# EAGLE design Narrow AAA sensor (EAGLE 8.3.1)
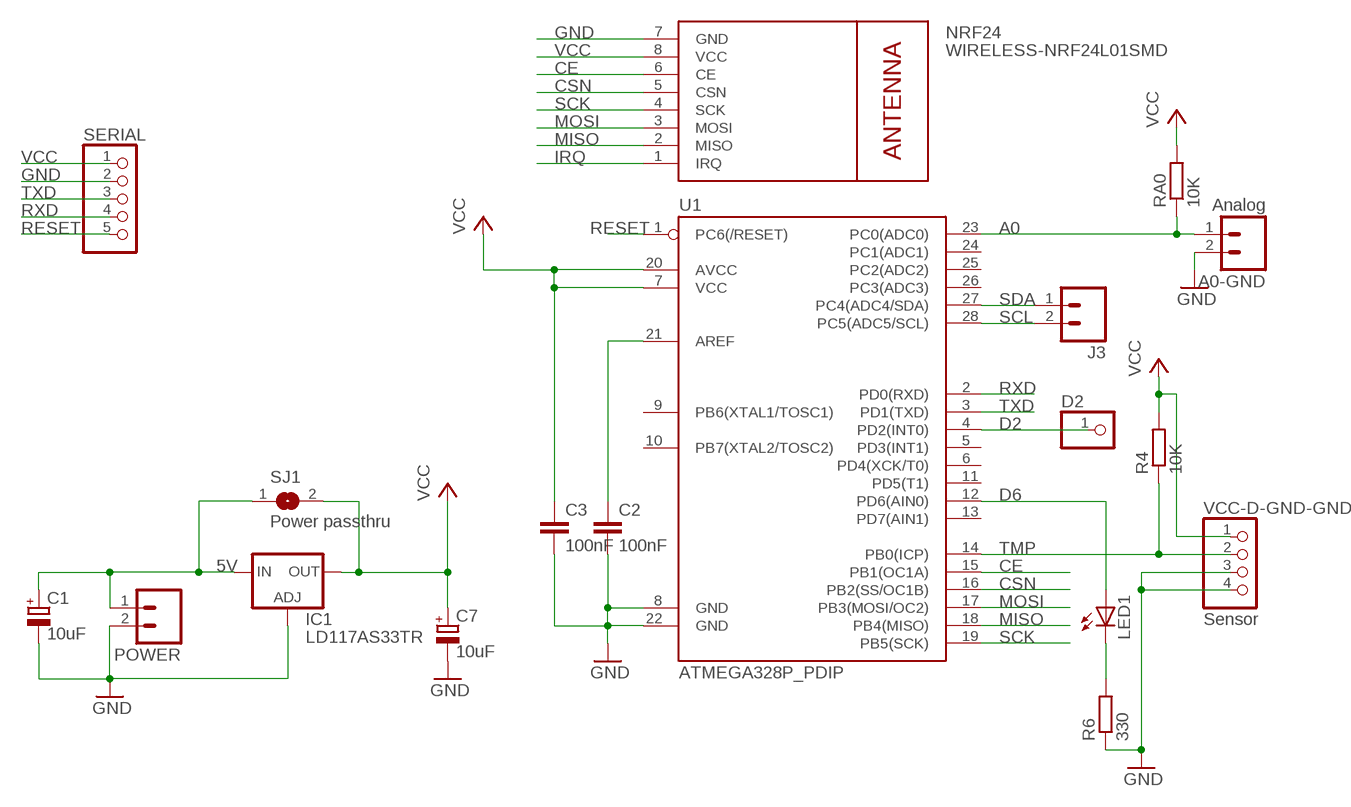
[diagram p0: schematic, sheet 1]

## Parts
A0-GND  Analog  M02PTH  [1X02]
C1  10uF  CPOL-EUE2.5-5  [E2,5-5]
C2  100nF  C-EU025-025X050  [C025-025X050]
C3  100nF  C-EU025-025X050  [C025-025X050]
C7  10uF  CPOL-EUE2.5-5  [E2,5-5]
D2  PINHD-1X1  [1X01]
IC1  LD117AS33TR  [SOT223]
J3  M021X02_NO_SILK  [1X02_NO_SILK]
LED1  LED3MM  [LED3MM]
NRF24  WIRELESS-NRF24L01SMD  [WIRELESS-NRF24L01-SMD]
POWER  M021X02_NO_SILK  [1X02_NO_SILK]
R4  10K  R-EU_0204/7  [0204/7]
R6  330  R-EU_0204/7  [0204/7]
RA0  10K  R-EU_0204/7  [0204/7]
SERIAL  PINHD-1X5  [1X05]
SJ1  Power passthru  SJ  [SJ]
U1  ATMEGA328P_PDIP  [DIL28-3]
VCC-D-GND-GND  Sensor  PINHD-1X4  [1X04]

## Nets
5V: C1.+ IC1.3(IN) POWER.1 SJ1.1
A0: A0-GND.1 RA0.1 U1.23(PC0(ADC0))
CE: NRF24.6(CE) U1.15(PB1(OC1A))
CSN: NRF24.5(CSN) U1.16(PB2(SS/OC1B))
D2: D2.1 U1.4(PD2(INT0))
D6: LED1.A U1.12(PD6(AIN0))
GND [power]: A0-GND.2 C1.- C2.2 C3.2 C7.- IC1.1(ADJ) NRF24.7(GND) POWER.2 R6.1 SERIAL.2 U1.8(GND) U1.22(GND) VCC-D-GND-GND.3 VCC-D-GND-GND.4
IRQ: NRF24.1(IRQ)
MISO: NRF24.2(MISO) U1.18(PB4(MISO))
MOSI: NRF24.3(MOSI) U1.17(PB3(MOSI/OC2))
N$1: LED1.K(C) R6.2
N$8: C2.1 U1.21(AREF)
RESET: SERIAL.5 U1.1(PC6(/RESET))
RXD: SERIAL.4 U1.2(PD0(RXD))
SCK: NRF24.4(SCK) U1.19(PB5(SCK))
SCL: J3.2 U1.28(PC5(ADC5/SCL))
SDA: J3.1 U1.27(PC4(ADC4/SDA))
TMP: R4.1 U1.14(PB0(ICP)) VCC-D-GND-GND.2
TXD: SERIAL.3 U1.3(PD1(TXD))
VCC [power]: C3.1 C7.+ IC1.4(OUT) NRF24.8(VCC) R4.2 RA0.2 SERIAL.1 SJ1.2 U1.7(VCC) U1.20(AVCC) VCC-D-GND-GND.1
Unconnected: U1.5(PD3(INT1)) U1.6(PD4(XCK/T0)) U1.9(PB6(XTAL1/TOSC1)) U1.10(PB7(XTAL2/TOSC2)) U1.11(PD5(T1)) U1.13(PD7(AIN1)) U1.24(PC1(ADC1)) U1.25(PC2(ADC2)) U1.26(PC3(ADC3))

## Library data of the parts
A0-GND J3 POWER = SparkFun-Connectors:M02: Standard 2-pin 0.1" header. Use with - straight break away headers ( PRT-00116) - right angle break away headers (PRT-00553) - swiss pins (PRT-00743) - machine pins (PRT-00117) - female headers (PRT-00115) Molex polarized connector foot print use with: PRT-08233 with associated crimp pins and housings. 2.54_SCREWTERM for use with PRT-10571. 3.5mm Screw Terminal footprints for PRT-08084 5mm Screw Terminal footprints for use with PRT-08432
C1 C7 = rcl:CPOL-EU: POLARIZED CAPACITOR, European symbol
C2 C3 = GertSanders:C-EU: CAPACITOR, European symbol
D2 = pinhead:PINHD-1X1: PIN HEADER
IC1 = v-reg:LD117A?*: Low drop fixed and adjustable positive voltage regulators 1 A Source: http://www.st.com/stonline/products/literature/ds/7194/ld1117axx.pdf
LED1 = adafruit:LED: LED OSRAM: - CHIPLED LG R971, LG N971, LY N971, LG Q971, LY Q971, LO R971, LY R971 LH N974, LH R974 LS Q976, LO Q976, LY Q976 LO Q996 - Hyper CHIPLED LW Q18S LB Q993, LB Q99A, LB R99A - SideLED LS A670, LO A670, LY A670, LG A670, LP A670 LB A673, LV A673, LT A673, LW A673 LH A674 LY A675 LS A676, LA A676, LO A676, LY A676, LW A676 LS A679, LY A679, LG A679 - Hyper Micro SIDELED® LS Y876, LA Y876, LO Y876, LY Y876 LT Y87S - SmartLED LW L88C, LW L88S LB L89C, LB L89S, LG L890 LS L89K, LO L89K, LY L89K LS L896, LA L896, LO L896, LY L896 - TOPLED LS T670, LO T670, LY T670, LG T670, LP T670 LSG T670, LSP T670, LSY T670, LOP T670, LYG T670 LG T671, LOG T671, LSG T671 LB T673, LV T673, LT T673, LW T673 LH T674 LS T676, LA T676, LO T676, LY T676, LB T676, LH T676, LSB T676, LW T676 LB T67C, LV T67C, LT T67C, LS T67K, LO T67K, LY T67K, LW E67C LS E67B, LA E67B, LO E67B, LY E67B, LB E67C, LV E67C, LT E67C LW T67C LS T679, LY T679, LG T679 LS T770, LO T770, LY T770, LG T770, LP T770 LB T773, LV T773, LT T773, LW T773 LH T774 LS E675, LA E675, LY E675, LS T675 LS T776, LA T776, LO T776, LY T776, LB T776 LHGB T686 LT T68C, LB T68C - Hyper Mini TOPLED® LB M676 - Mini TOPLED Santana® LG M470 LS M47K, LO M47K, LY M47K Source: http://www.osram.convergy.de/
NRF24 = GertSanders:WIRELESS-NRF24L01: 2.4 GHz Wireless Module based on NRF24L01 chip
R4 R6 RA0 = rcl:R-EU_: RESISTOR, European symbol
SERIAL = pinhead:PINHD-1X5: PIN HEADER
SJ1 = jumper:SJ: SMD solder JUMPER
U1 = GertSanders:ATMEGA328P_PDIP: uC used in the Arduino 32kb flash, 1k EEPROM, 2k SRAM This is the through-hole version of this chip.
VCC-D-GND-GND = pinhead:PINHD-1X4: PIN HEADER

## Net classes
1 power: width 0.356 mm, clearance 0.178 mm

## Board
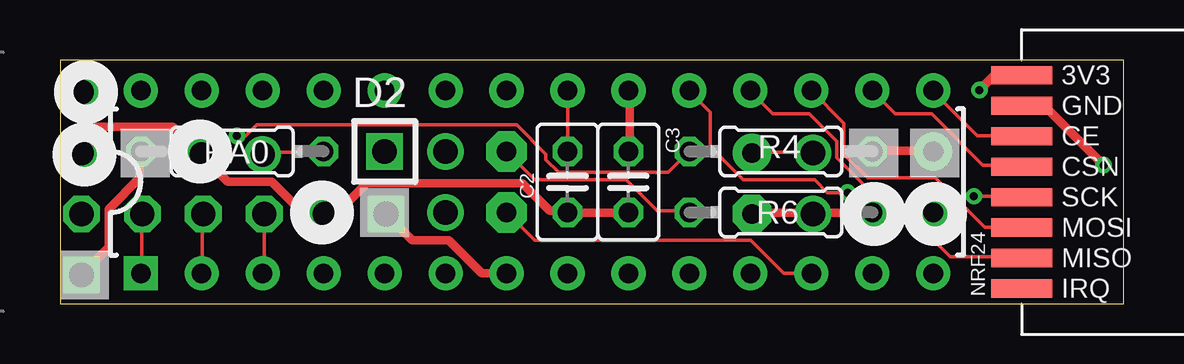
[diagram p1: board, top side]
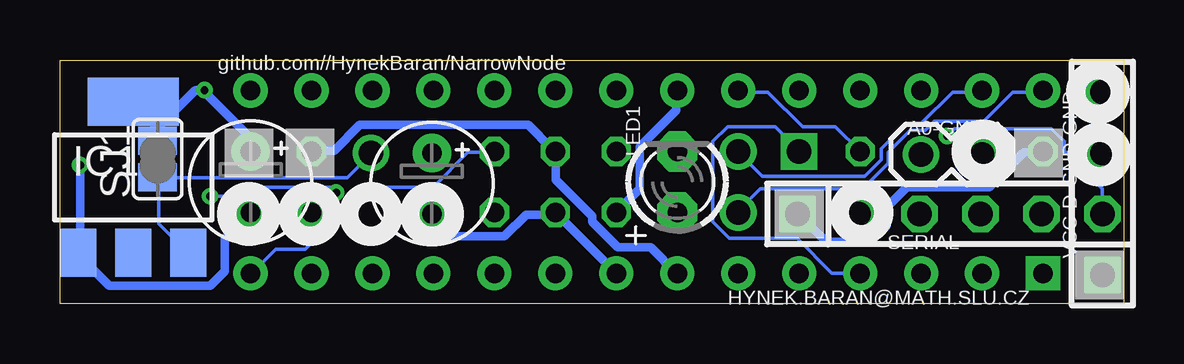
[diagram p2: board, bottom side, seen from below]

Size 44.32 x 10.16 mm. Coordinates in mm from the lower left corner, seen from the top.
Outline: 0,0 44.32,0 44.32,10.16 0,10.16 0,0
Copper layers (1*16): Top 0.0356mm / dielectric 1.5011mm / Bottom 0.0356mm
Design rules "oshpark-2layer": minimum track width 6mil, minimum drill 13mil, track to track 6mil, track to pad 6mil, pad to pad 6mil, via to via 6mil, smd to smd 6mil, copper to edge 15mil, drill to drill 6mil, minimum pad ring 7mil, minimum via ring 7mil, stop-mask expansion 2.5mil, vias tented up to drill 0mil, thermal gap 10mil

### Footprints (pad centres in the part's own frame; a part is rotated, then mirrored left to right if it is on the bottom)
1X02 = drill 1.016 pad 1.422: 1 0,0; 2 2.54,0
E2,5-5 = drill 0.813 pad 1.6: + -1.27,0 | drill 0.813 pad 1.6 octagon: - 1.27,0
C025-025X050 = drill 0.813 octagon: 1 -1.27,0; 2 1.27,0
1X01 = drill 1.016 square: 1 0,0
SOT223 = smd 1.5 x 2: 1 -2.3,-3.15; 2 0,-3.15; 3 2.3,-3.15 | smd 3.8 x 2: 4 0,3.15
1X02_NO_SILK = drill 1.016 pad 1.422: 1 0,0; 2 2.54,0
LED3MM = drill 0.813 pad 1.676 octagon: A -1.27,0; K 1.27,0
WIRELESS-NRF24L01-SMD = smd 2.54 x 0.762: 1 1.27,0; 2 1.27,1.27; 3 1.27,2.54; 4 1.27,3.81; 5 1.27,5.08; 6 1.27,6.35; 7 1.27,7.62; 8 1.27,8.89
0204/7 = drill 0.813 octagon: 1 -3.81,0; 2 3.81,0
1X05 = drill 1.016 square: 1 -5.08,0 | drill 1.016 octagon: 2 -2.54,0; 3 0,0; 4 2.54,0; 5 5.08,0
SJ = smd 1.168 x 1.6: 1 -0.762,0; 2 0.762,0
DIL28-3 = drill 0.813 pad 1.422 square: 1 -16.51,-3.81 | drill 0.813 pad 1.422: 2 -13.97,-3.81; 3 -11.43,-3.81; 4 -8.89,-3.81; 5 -6.35,-3.81; 6 -3.81,-3.81; 7 -1.27,-3.81; 8 1.27,-3.81; 9 3.81,-3.81; 10 6.35,-3.81; 11 8.89,-3.81; 12 11.43,-3.81; 13 13.97,-3.81; 14 16.51,-3.81; 15 16.51,3.81; 16 13.97,3.81; 17 11.43,3.81; 18 8.89,3.81; 19 6.35,3.81; 20 3.81,3.81; 21 1.27,3.81; 22 -1.27,3.81; 23 -3.81,3.81; 24 -6.35,3.81; 25 -8.89,3.81; 26 -11.43,3.81; 27 -13.97,3.81; 28 -16.51,3.81
1X04 = drill 1.016 square: 1 -3.81,0 | drill 1.016 octagon: 2 -1.27,0; 3 1.27,0; 4 3.81,0

### Placement (x,y rotation side)
A0-GND  8.45,6.22 0 bottom
C1  28.83,5.02 270 bottom
C2  21.15,5.08 270 top
C3  23.69,5.08 270 top
C7  36.39,5.08 270 bottom
D2  13.53,6.35 0 top
IC1  41.27,5.27 0 bottom
J3  16.07,6.35 270 top
LED1  18.61,5.08 90 bottom
NRF24  38.8,0.64 0 top
POWER  31.37,6.29 270 top
R4  30.04,6.35 0 top
R6  30.04,3.81 180 top
RA0  7.18,6.35 180 top
SERIAL  8.51,3.75 0 bottom
SJ1  40.26,6.03 90 bottom
U1  19.88,5.08 0 top
VCC-D-GND-GND  0.89,5.02 90 bottom

### Tracks (layer width: path | path; a pad name or v marks a point on that pad's centre or on a via)
5V
  Top 0.152: POWER.1 31.37,6.31 28.85,6.31 C1.+
  Bottom 0.152: IC1.3 38.99,2.12 40.21,3.34 40.21,5.25 SJ1.1 40.13,5.25 32.36,5.25 31.37,6.24 POWER.1
A0
  Top 0.152: RA0.1 10.95,6.31 8.58,6.31 8.51,6.24 A0-GND.1
  Bottom 0.152: RA0.1 12.01,7.38 13.39,7.38 14.83,8.83 16.05,8.83 U1.23
CE
  Top 0.152: NRF24.6 40.06,7 38.23,7 36.4,8.83 U1.15
CSN
  Top 0.152: NRF24.5 40.06,5.78 38.46,5.78 36.32,7.91 34.8,7.91 33.88,8.83 U1.16
D2
  Bottom 0.152: U1.4 11.02,1.28 12.17,1.28 13.61,2.73 16.43,2.73 17.12,3.42 17.12,6.77 16.51,7.38 14.53,7.38 13.54,6.39 D2.1
D6
  Top 0.152: U1.12 30.15,1.28 28.78,2.65 19.79,2.65 18.64,3.8 LED1.A
GND  (via drill 0.33)
  Top 0.356: VCC-D-GND-GND.4 0.89,7.38 | 0.89,7.38 VCC-D-GND-GND.3 | 0.89,7.38 4.7,7.38 5.77,6.31 A0-GND.2 5.92,6.16 6.98,5.09 8.81,5.09 10.11,3.8 11.02,3.8 SERIAL.2 11.18,3.87 11.63,3.87 12.78,5.02 19.25,5.02 20.4,3.87 21.01,3.87 C2.2 21.16,3.8 23.67,3.8 C3.2 | v43.48,5.78 41.05,8.22 40.13,8.22 NRF24.7 | R6.1 33.81,3.8 31.37,3.8 POWER.2 31.22,3.8 28.85,3.8 C1.-
  Bottom 0.356: U1.8 C3.2 23.83,3.72 24.89,3.72 25.81,2.81 27.86,2.81 28.78,3.72 C1.- | C2.2 20.17,4.79 20.17,6.54 18.64,8.06 18.64,8.83 U1.22 | R6.1 33.88,3.8 36.25,3.8 C7.- 37.47,2.73 37.47,1.36 38.08,0.75 42.27,0.75 43.56,2.04 IC1.1 43.48,2.27 v43.48,5.78
MISO
  Top 0.152: NRF24.2 40.06,1.97 37.08,1.97 36.32,2.73 35.94,2.73 34.72,3.95 34.72,4.18 33.96,4.94 33.5,4.94 32.36,6.08 32.36,6.77 31.22,7.91 29.69,7.91 28.78,8.83 U1.18
MOSI
  Top 0.152: U1.17 32.66,7.53 32.66,6.24 33.66,5.25 36.47,5.25 38.53,3.19 40.06,3.19 NRF24.3
N$1
  Top 0.152: LED1.K 19.79,5.17 23.6,5.17 24.89,3.87 26.19,3.87 R6.2
N$8
  Top 0.152: C2.1 21.16,6.39 21.16,8.83 U1.21
RESET
  Top 0.152: U1.1 3.4,1.28 3.4,3.72 SERIAL.5
RXD
  Top 0.152: U1.2 5.92,1.28 5.92,3.72 SERIAL.4
SCK  (via drill 0.33)
  Top 0.152: v38.08,4.48 40.06,4.48 NRF24.4 | v32.82,4.64 31.98,4.64 31.45,5.17 28.47,5.17 27.1,6.54 27.1,7.99 26.26,8.83 U1.19
  Bottom 0.152: v38.08,4.48 37.24,4.48 36.86,4.86 33.05,4.86 v32.82,4.64
SCL
  Bottom 0.152: U1.28 3.4,8.83 4.62,8.83 5.84,7.61 7.9,7.61 8.28,7.23 8.89,7.23 9.8,6.31 9.8,5.85 10.87,4.79 15.14,4.79 16.05,3.87 J3.2
SDA
  Bottom 0.152: U1.27 5.92,8.83 7.14,8.83 8.43,7.53 9.04,7.53 10.11,6.46 10.11,6.01 10.79,5.32 15.06,5.32 16.05,6.31 J3.1
TMP  (via drill 0.33)
  Top 0.152: v7.37,7 7.75,7 8.2,7.45 19.03,7.45 20.24,6.24 20.24,6.01 20.78,5.47 25.35,5.47 R4.1
  Bottom 0.152: R4.1 26.26,6.31 27.33,6.31 28.78,4.86 31.75,4.86 32.97,3.64 32.97,3.42 34.11,2.27 35.33,2.27 36.32,1.28 U1.14 | VCC-D-GND-GND.2 0.89,4.79 2.49,6.39 2.49,6.77 3.02,7.3 7.06,7.3 v7.37,7
TXD
  Top 0.152: SERIAL.3 8.51,1.28 U1.3
VCC  (via drill 0.33)
  Top 0.356: R4.2 33.88,6.39 36.32,6.39 C7.+ | v38.3,8.9 38.91,9.51 40.06,9.51 NRF24.8 | VCC-D-GND-GND.1 2.03,2.35 2.03,3.95 3.33,5.25 3.33,6.31 RA0.2 | C3.1 23.75,6.39 23.75,8.83 U1.20 | SERIAL.1 14.68,2.65 16.21,2.65 17.58,1.28 18.57,1.28 U1.7
  Bottom 0.356: SJ1.2 40.28,6.85 40.28,7.38 41.27,8.37 IC1.4 40.13,7.45 38.68,8.9 v38.3,8.9 38.23,8.75 36.4,6.92 36.4,6.39 C7.+ | U1.7 18.64,1.28 19.71,2.35 21.08,2.35 22.15,3.42 22.15,3.64 23.67,5.17 23.67,6.31 C3.1 23.83,6.46 24.82,7.45 31.83,7.45 32.89,6.39 33.81,6.39 R4.2 | RA0.2 3.4,6.31 4.17,6.31 5.61,4.86 9.04,4.86 9.88,4.03 9.88,3.26 10.57,2.58 12.39,2.58 13.54,3.72 SERIAL.1

### Text on the board
bNames: github.com//HynekBaran/NarrowNode | HYNEK.BARAN@MATH.SLU.CZ